# Altium schematic sheet RELAY9.SchDoc
size A
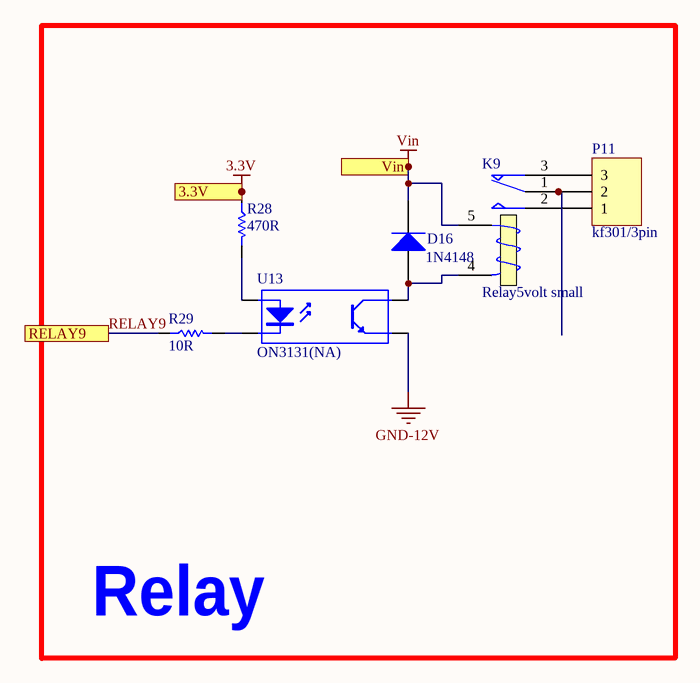
[diagram p0: RELAY9.SchDoc]

## Parts
D16  1N4148  [sod123]
K9  Relay5volt small  [relay5_childern]
P11  kf301/3pin  [Blue Connector 1*3 -kf301]
R28  470R  [0805/resistor]
R29  10R  [0805/resistor]
U13  ON3131(NA)  [OPTO_COUPLER]

## Blocks framed on the sheet
Relay: D16 K9 P11 R28 R29 U13

## Ports
3.3V, RELAY9, Vin

## Nets
3.3V: R28.1 ; port 3.3V
GND-12V: U13.3(E)
Vin: D16.K K9.5 ; port Vin
RELAY9: R29.1 ; port RELAY9
NetD16_A: D16.A K9.4(T2) U13.4(C)
NetK9_1: K9.1(COM) P11.2
NetK9_2: K9.2(NO) P11.1
NetK9_3: K9.3(T1) P11.3
NetR28_2: R28.2 U13.1(A)
NetR29_2: R29.2 U13.2(K)

## Library data of the parts
D16 = Diode 1N4007: 1 Amp General Purpose Rectifier; Published: 8-Jun-2000; LatestRevisionDate: 17-Jul-2002; LatestRevisionNote: Re-released for DXP Platform.; DatasheetVersion: 1998; PackageVersion: Aug-1999; PackageReference: DO-41; Publisher: Altium Limited; PackageDescription: Diode, Axial; Body 5.2 x 2.7 mm (LxDia. max), Lead Dia. 0.86 mm (max); Code_JEDEC: DO-204-AL; ComponentLink1Description: Manufacturer Link; ComponentLink1URL: http://www.fairchildsemi.com/; ComponentLink2Description: Datasheet; ComponentLink2URL: http://www.fairchildsemi.com/ds/1N%2F1N4001.pdf
K9 = Relay: SPDT Relay; Published: 8-Jun-2000; LatestRevisionDate: 17-Jul-2002; LatestRevisionNote: Re-released for DXP Platform.; PackageReference: MODULE5B; Publisher: Altium Limited
P11 = Header 3: LatestRevisionDate: 17-Jul-2002; LatestRevisionNote: Re-released for DXP Platform.; Publisher: Altium Limited
R28 R29 = Resistor: Tolerance: 5%; Power: 1/8 W
  R28: Value: 470R
  R29: Value: 10R
U13 = Optoisolator1: 4-Pin Phototransistor Optocoupler; Published: 24-Mar-1999; LatestRevisionDate: 04-Mar-2005; LatestRevisionNote: Sch pins 3 & 4 Swapped.; DatasheetVersion: Nov-2003; PackageReference: DIP-4; Publisher: Altium Limited